# EAGLE design Pro Trinket Keyboard V3.1 (EAGLE 6.6.0)
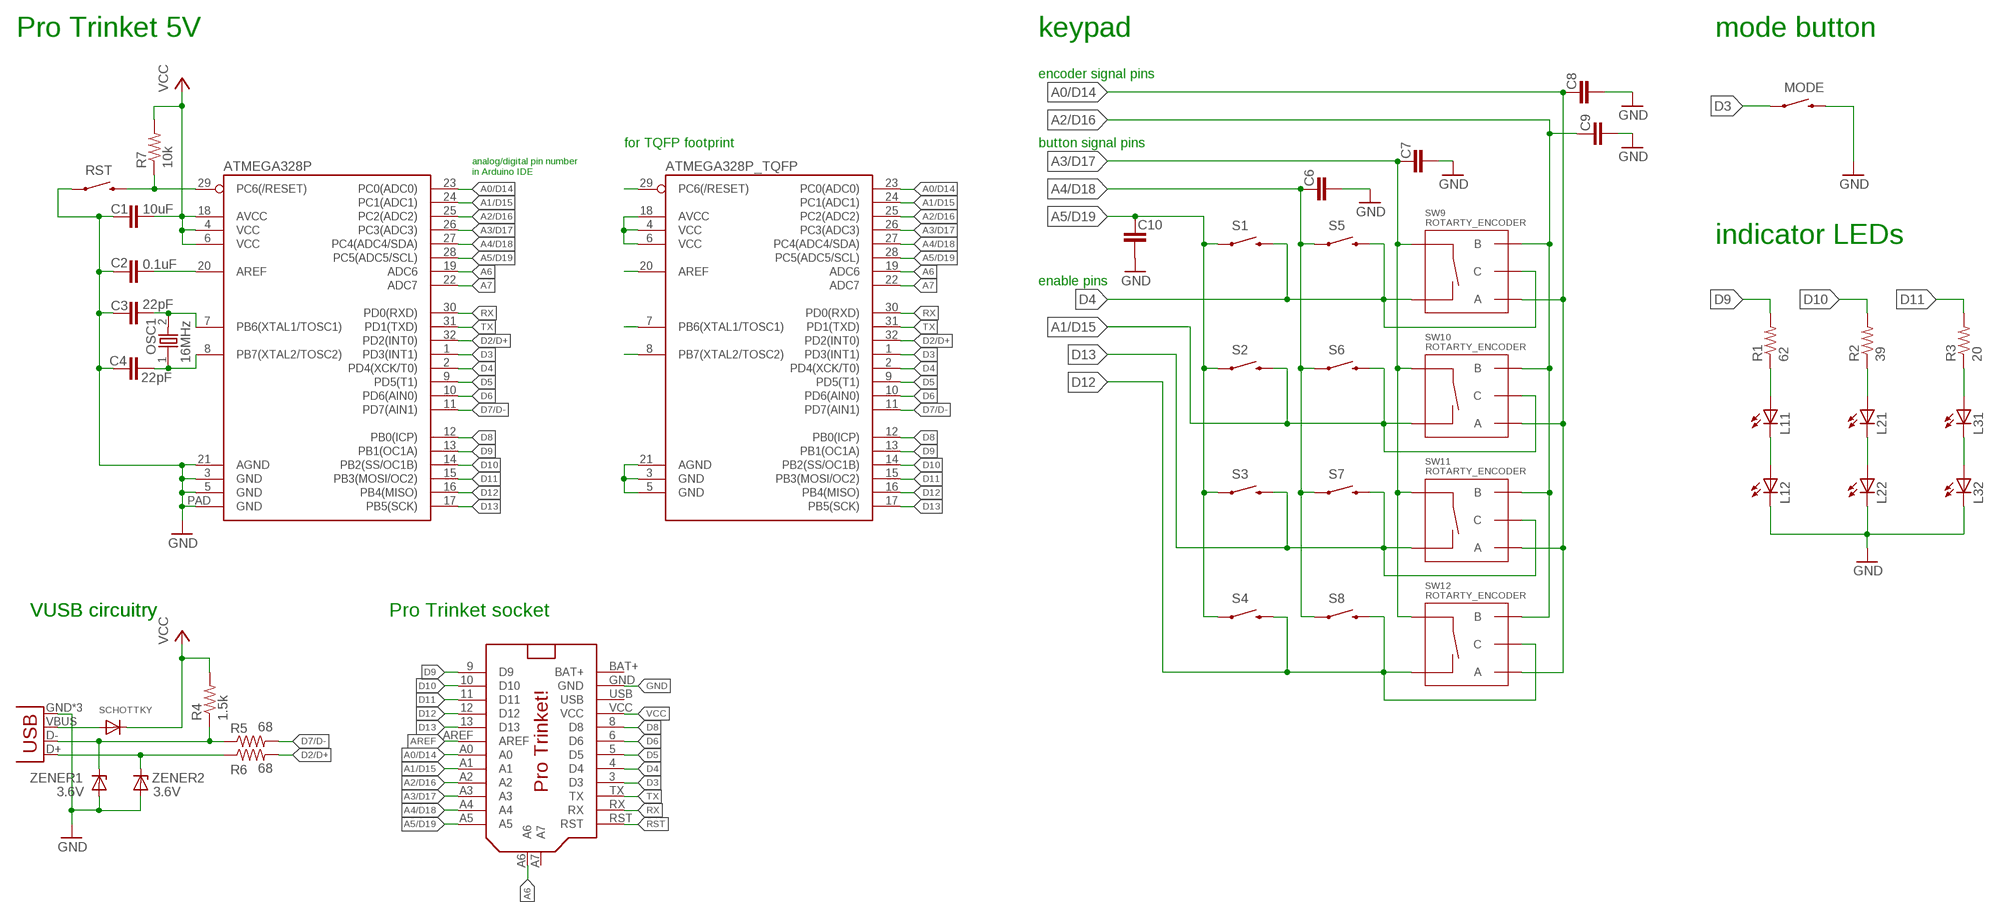
[diagram p0: schematic, sheet 1]

## Parts
ATMEGA328P  ATMEGA328P_MLFMLF32  [MLF32-PAD]
ATMEGA328P_TQFP  ATMEGA328P_TQFP  [TQFP32-08]
C1  10uF  10UF-6.3V-20%(0603)  [0603-CAP]
C2  0.1uF  22PF-50V-5%(0603)  [0603-CAP]
C3  22pF  22PF-50V-5%(0603)  [0603-CAP]
C4  22pF  22PF-50V-5%(0603)  [0603-CAP]
C6  22PF-50V-5%(0603)  [0603-CAP]
C7  22PF-50V-5%(0603)  [0603-CAP]
C8  22PF-50V-5%(0603)  [0603-CAP]
C9  22PF-50V-5%(0603)  [0603-CAP]
C10  22PF-50V-5%(0603)  [0603-CAP]
JP1  USB-MICROB  [USB-MICROB]
L11  LEDCHIPLED_0805  [CHIPLED_0805]
L12  LEDCHIPLED_0805  [CHIPLED_0805]
L21  LEDCHIPLED_0805  [CHIPLED_0805]
L22  LEDCHIPLED_0805  [CHIPLED_0805]
L31  LEDCHIPLED_0805  [CHIPLED_0805]
L32  LEDCHIPLED_0805  [CHIPLED_0805]
MODE  SWITCH-MOMENTARY-2SIDE_EZ  [TACTILE-PTH-SIDEEZ]
OSC1  16MHz  OSC-XTAL-HC-49U-SMD  [HC-49U]
R1  62  R-US_M0805  [M0805]
R2  39  R-US_M0805  [M0805]
R3  20  R-US_M0805  [M0805]
R4  1.5k  RESISTOR0805-RES  [0805]
R5  68  RESISTOR0805-RES  [0805]
R6  68  RESISTOR0805-RES  [0805]
R7  10k  RESISTOR0805-RES  [0805]
RST  SWITCH-MOMENTARY-2SIDE_EZ  [TACTILE-PTH-SIDEEZ]
S1  SWITCH-MOMENTARY-212MM  [TACTILE-PTH-12MM]
S2  SWITCH-MOMENTARY-212MM  [TACTILE-PTH-12MM]
S3  SWITCH-MOMENTARY-212MM  [TACTILE-PTH-12MM]
S4  SWITCH-MOMENTARY-212MM  [TACTILE-PTH-12MM]
S5  SWITCH-MOMENTARY-212MM  [TACTILE-PTH-12MM]
S6  SWITCH-MOMENTARY-212MM  [TACTILE-PTH-12MM]
S7  SWITCH-MOMENTARY-212MM  [TACTILE-PTH-12MM]
S8  SWITCH-MOMENTARY-212MM  [TACTILE-PTH-12MM]
SCHOTTKY  DIODESMA  [SMADIODE]
SW9  ROTARTY_ENCODER  [ROTARY_ENC_PLAIN]
SW10  ROTARTY_ENCODER  [ROTARY_ENC_PLAIN]
SW11  ROTARTY_ENCODER  [ROTARY_ENC_PLAIN]
SW12  ROTARTY_ENCODER  [ROTARY_ENC_PLAIN]
U$2  PRO_TRINKET  [PROTRINKET]
ZENER1  3.6V  ZENER-DIODESOD80C  [SOD80C]
ZENER2  3.6V  ZENER-DIODESOD80C  [SOD80C]

## Nets
A0/D14: ATMEGA328P.23(PC0(ADC0)) ATMEGA328P_TQFP.23(PC0(ADC0)) C8.1 SW9.A SW10.A SW11.A SW12.A U$2.A0
A1/D15: ATMEGA328P.24(PC1(ADC1)) ATMEGA328P_TQFP.24(PC1(ADC1)) S2.3 S2.4 S6.3 S6.4 SW10.C SW10.SW- U$2.A1
A2/D16: ATMEGA328P.25(PC2(ADC2)) ATMEGA328P_TQFP.25(PC2(ADC2)) C9.1 SW9.B SW10.B SW11.B SW12.B U$2.A2
A3/D17: ATMEGA328P.26(PC3(ADC3)) ATMEGA328P_TQFP.26(PC3(ADC3)) C7.1 SW9.SW+ SW10.SW+ SW11.SW+ SW12.SW+ U$2.A3
A4/D18: ATMEGA328P.27(PC4(ADC4/SDA)) ATMEGA328P_TQFP.27(PC4(ADC4/SDA)) C6.1 S5.1 S5.2 S6.1 S6.2 S7.1 S7.2 S8.1 S8.2 U$2.A4
A5/D19: ATMEGA328P.28(PC5(ADC5/SCL)) ATMEGA328P_TQFP.28(PC5(ADC5/SCL)) C10.1 S1.1 S1.2 S2.1 S2.2 S3.1 S3.2 S4.1 S4.2 U$2.A5
A6: ATMEGA328P.19(ADC6) ATMEGA328P_TQFP.19(ADC6) U$2.A6
A7: ATMEGA328P.22(ADC7) ATMEGA328P_TQFP.22(ADC7)
AREF: ATMEGA328P.20(AREF) ATMEGA328P_TQFP.20(AREF) C2.2 U$2.AREF
D2/D+: ATMEGA328P.32(PD2(INT0)) ATMEGA328P_TQFP.32(PD2(INT0)) R6.2
D3: ATMEGA328P.1(PD3(INT1)) ATMEGA328P_TQFP.1(PD3(INT1)) MODE.1 U$2.3(D3)
D4: ATMEGA328P.2(PD4(XCK/T0)) ATMEGA328P_TQFP.2(PD4(XCK/T0)) S1.3 S1.4 S5.3 S5.4 SW9.C SW9.SW- U$2.4(D4)
D5: ATMEGA328P.9(PD5(T1)) ATMEGA328P_TQFP.9(PD5(T1)) U$2.5(D5)
D6: ATMEGA328P.10(PD6(AIN0)) ATMEGA328P_TQFP.10(PD6(AIN0)) U$2.6(D6)
D7/D-: ATMEGA328P.11(PD7(AIN1)) ATMEGA328P_TQFP.11(PD7(AIN1)) R5.2
D8: ATMEGA328P.12(PB0(ICP)) ATMEGA328P_TQFP.12(PB0(ICP)) U$2.8(D8)
D9: ATMEGA328P.13(PB1(OC1A)) ATMEGA328P_TQFP.13(PB1(OC1A)) R1.2 U$2.9(D9)
D10: ATMEGA328P.14(PB2(SS/OC1B)) ATMEGA328P_TQFP.14(PB2(SS/OC1B)) R2.2 U$2.10(D10)
D11: ATMEGA328P.15(PB3(MOSI/OC2)) ATMEGA328P_TQFP.15(PB3(MOSI/OC2)) R3.2 U$2.11(D11)
D12: ATMEGA328P.16(PB4(MISO)) ATMEGA328P_TQFP.16(PB4(MISO)) S4.3 S4.4 S8.3 S8.4 SW12.C SW12.SW- U$2.12(D12)
D13: ATMEGA328P.17(PB5(SCK)) ATMEGA328P_TQFP.17(PB5(SCK)) S3.3 S3.4 S7.3 S7.4 SW11.C SW11.SW- U$2.13(D13)
GND: ATMEGA328P.3(GND) ATMEGA328P.5(GND) ATMEGA328P.21(AGND) ATMEGA328P.PAD(GND) ATMEGA328P_TQFP.3(GND) ATMEGA328P_TQFP.5(GND) ATMEGA328P_TQFP.21(AGND) C1.1 C2.1 C3.1 C4.2 C6.2 C7.2 C8.2 C9.2 C10.2 JP1.GND JP1.MT1(GND) JP1.MT2(GND) L12.C L22.C L32.C MODE.2 RST.1 U$2.GND ZENER1.A ZENER2.A
L31: L31.C L32.A
N$1: L11.A R1.1
N$2: L11.C L12.A
N$3: L21.A R2.1
N$4: L21.C L22.A
N$5: L31.A R3.1
N$10: JP1.VBUS SCHOTTKY.A
N$11: JP1.D- R4.1 R5.1 ZENER1.C
N$12: JP1.D+ R6.1 ZENER2.C
RST: ATMEGA328P.29(PC6(/RESET)) ATMEGA328P_TQFP.29(PC6(/RESET)) R7.1 RST.2 U$2.RST
RX: ATMEGA328P.30(PD0(RXD)) ATMEGA328P_TQFP.30(PD0(RXD)) U$2.RX
TX: ATMEGA328P.31(PD1(TXD)) ATMEGA328P_TQFP.31(PD1(TXD)) U$2.TX
VCC: ATMEGA328P.4(VCC) ATMEGA328P.6(VCC) ATMEGA328P.18(AVCC) ATMEGA328P_TQFP.4(VCC) ATMEGA328P_TQFP.6(VCC) ATMEGA328P_TQFP.18(AVCC) C1.2 R4.2 R7.2 SCHOTTKY.C U$2.VCC
XTAL1: ATMEGA328P.7(PB6(XTAL1/TOSC1)) ATMEGA328P_TQFP.7(PB6(XTAL1/TOSC1)) C3.2 OSC1.2
XTAL2: ATMEGA328P.8(PB7(XTAL2/TOSC2)) ATMEGA328P_TQFP.8(PB7(XTAL2/TOSC2)) C4.1 OSC1.1
Unconnected: U$2.A7

## Notes on the sheet
- Pro Trinket 5V | keypad | mode button
- encoder signal pins
- for TQFP footprint | button signal pins
- analog/digital pin number
  in Arduino IDE
- indicator LEDs
- enable pins
- VUSB circuitry | VUSB circuitry | Pro Trinket socket

## Power pins joined to a net without a drawn wire
BAT+: U$2.BAT+
USB: U$2.USB

## Library data of the parts
ATMEGA328P = SparkFun-DigitalIC:ATMEGA328P_MLF: 32-Pin Atmega328 part Commonly used on Arduino compatible boards Available in QFP and QFN packages TQFP is IC-09069 QFN is non-stock
ATMEGA328P_TQFP = SparkFun-DigitalIC:ATMEGA328P_TQFP; PROD_ID: IC-09069; VALUE: ATMEGA328P_TQFP
C1 = SparkFun-Capacitors:10UF-6.3V-20%(0603): CAP-11015; PROD_ID: CAP-11015
C2 C6-C10 = SparkFun-Capacitors:22PF-50V-5%(0603): CAP-07876; PROD_ID: CAP-07876; VALUE: 22pF
C3 C4 = SparkFun-Capacitors:22PF-50V-5%(0603): CAP-07876; PROD_ID: CAP-07876
JP1 = SparkFun-Connectors:USB: USB Connectors USB-B-PTH is fully proven SKU : PRT-00139/CONN-08278 USB-miniB is fully proven SKU : PRT-00587 USB-A-PCB is untested. USB-A-H is throughly reviewed, but untested. Spark Fun Electronics SKU : PRT-00437 USB-B-SMT is throughly reviewed, but untested. Needs silkscreen touching up. USB-A-S has not been used/tested USB-MB-H has not been used/tested USB-MICROB has been used. CONN-09505; PROD_ID: CONN-09505
L11 L12 L21 L22 L31 L32 = adafruit:LED: LED OSRAM: - CHIPLED LG R971, LG N971, LY N971, LG Q971, LY Q971, LO R971, LY R971 LH N974, LH R974 LS Q976, LO Q976, LY Q976 LO Q996 - Hyper CHIPLED LW Q18S LB Q993, LB Q99A, LB R99A - SideLED LS A670, LO A670, LY A670, LG A670, LP A670 LB A673, LV A673, LT A673, LW A673 LH A674 LY A675 LS A676, LA A676, LO A676, LY A676, LW A676 LS A679, LY A679, LG A679 - Hyper Micro SIDELED® LS Y876, LA Y876, LO Y876, LY Y876 LT Y87S - SmartLED LW L88C, LW L88S LB L89C, LB L89S, LG L890 LS L89K, LO L89K, LY L89K LS L896, LA L896, LO L896, LY L896 - TOPLED LS T670, LO T670, LY T670, LG T670, LP T670 LSG T670, LSP T670, LSY T670, LOP T670, LYG T670 LG T671, LOG T671, LSG T671 LB T673, LV T673, LT T673, LW T673 LH T674 LS T676, LA T676, LO T676, LY T676, LB T676, LH T676, LSB T676, LW T676 LB T67C, LV T67C, LT T67C, LS T67K, LO T67K, LY T67K, LW E67C LS E67B, LA E67B, LO E67B, LY E67B, LB E67C, LV E67C, LT E67C LW T67C LS T679, LY T679, LG T679 LS T770, LO T770, LY T770, LG T770, LP T770 LB T773, LV T773, LT T773, LW T773 LH T774 LS E675, LA E675, LY E675, LS T675 LS T776, LA T776, LO T776, LY T776, LB T776 LHGB T686 LT T68C, LB T68C - Hyper Mini TOPLED® LB M676 - Mini TOPLED Santana® LG M470 LS M47K, LO M47K, LY M47K Source: http://www.osram.convergy.de/
MODE RST = SparkFun-Electromechanical:SWITCH-MOMENTARY-2: Various NO switches- pushbuttons, reed, etc
OSC1 = dp_devices:OSC-XTAL
R1-R3 = adafruit:R-US_: RESISTOR, American symbol
R4-R7 = SparkFun-Passives:RESISTOR: Resistor Basic schematic elements and footprints for 0603, 1206, and PTH resistors.
S1-S8 = SparkFun-Electromechanical:SWITCH-MOMENTARY-2: Various NO switches- pushbuttons, reed, etc; PROD_ID: SWCH-09185
SCHOTTKY = adafruit:DIODE: Diode SMADIODE - SMA Surface Mount Package 20V 1A Schottky Diode Digikey: 641-1014-6-ND DO-1N4148 - Through Hole Small Current Diode SOD-123 20V 1 A (.5mV Vf) Schottky Diode - Digikey: MBRX120TPMSCT-ND SOD-323 10V 570mA (.38mV Vf, 3ns) Schottky Diode - Digikey: ZLLS410CT-ND SOD-523 30V 30mA Schottky Diode (RB751S-40TE61) - Digikey: RB751S-40TE61CT-ND SOT23-R/W - SOT23 Package (R = Solder Paste/Reflow Ovens, W = Hand-Soldering) BAT54Film 40V 300mA - Digikey: 497-7162-1-ND
SW9-SW12 = SparkFun-Electromechanical:ROTARTY_ENCODER: Simple no LED rotary encoder Example: COM-09117
U$2 = adafruit:PRO_TRINKET
ZENER1 ZENER2 = diode:ZENER-DIODE: Z-Diode

## Board
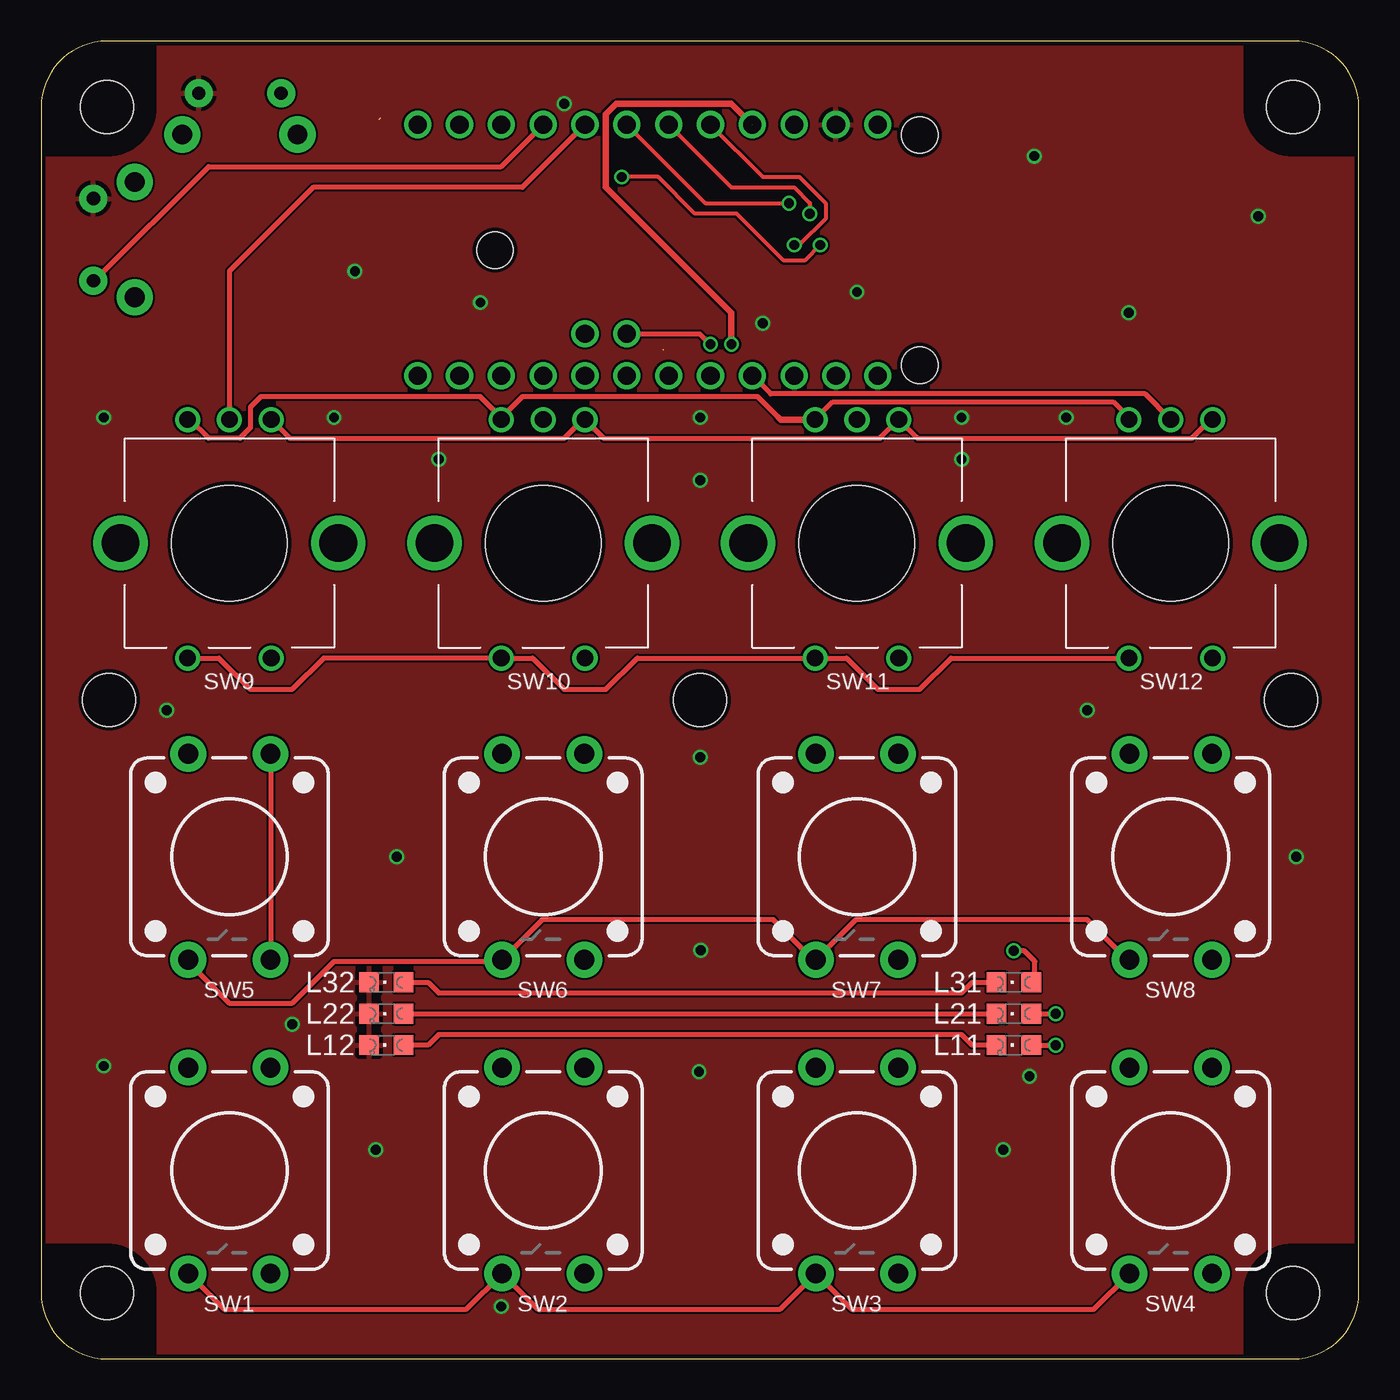
[diagram p1: board, top side]
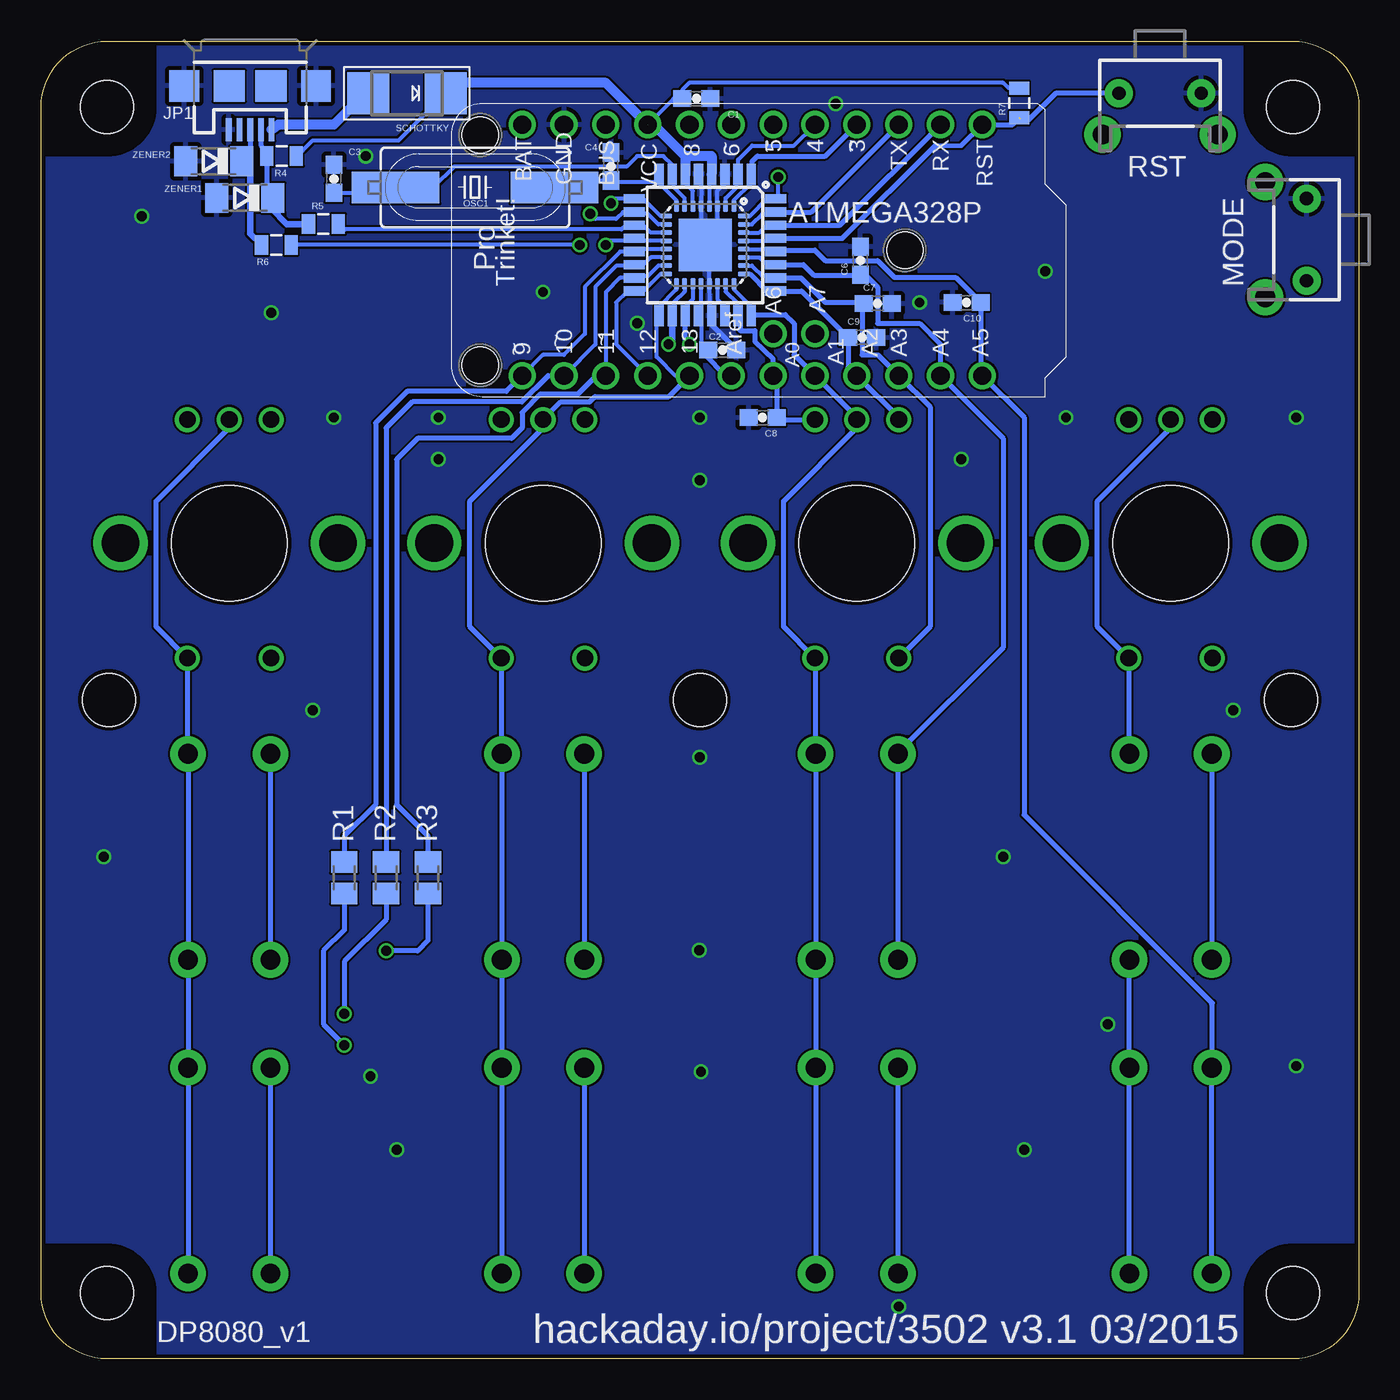
[diagram p2: board, bottom side, seen from below]

Size 80 x 80 mm. Coordinates in mm from the lower left corner, seen from the top.
Copper layers (1*16): Top 0.035mm / dielectric 1.5mm / Bottom 0.035mm
Design rules "dirt_cheap_dirty_boards.v1": minimum track width 5mil, minimum drill 12mil, track to track 5mil, track to pad 5mil, pad to pad 5mil, via to via 5mil, smd to smd 0mil, copper to edge 10mil, drill to drill 10mil, minimum pad ring 10mil, minimum via ring 6mil, stop-mask expansion 2mil, vias tented up to drill 25mil, thermal gap 10mil
Holes 7 mm at 11.43,49.53 30.48,49.53 49.53,49.53 68.58,49.53
Holes 3.2 mm at 40.01,40.01 4.13,40.01 75.88,40.01

### Footprints (pad centres in the part's own frame; a part is rotated, then mirrored left to right if it is on the bottom)
MLF32-PAD = smd 0.7 x 0.3: 1 -2.35,1.75; 2 -2.35,1.25; 3 -2.35,0.75; 4 -2.35,0.25; 5 -2.35,-0.25; 6 -2.35,-0.75; 7 -2.35,-1.25; 8 -2.35,-1.75; 17 2.35,-1.75; 18 2.35,-1.25; 19 2.35,-0.75; 20 2.35,-0.25; 21 2.35,0.25; 22 2.35,0.75; 23 2.35,1.25; 24 2.35,1.75 | smd 0.3 x 0.7: 9 -1.75,-2.35; 10 -1.25,-2.35; 11 -0.75,-2.35; 12 -0.25,-2.35; 13 0.25,-2.35; 14 0.75,-2.35; 15 1.25,-2.35; 16 1.75,-2.35; 25 1.75,2.35; 26 1.25,2.35; 27 0.75,2.35; 28 0.25,2.35; 29 -0.25,2.35; 30 -0.75,2.35; 31 -1.25,2.35; 32 -1.75,2.35 | smd 3.2 x 3.2: PAD 0,0
TQFP32-08 = smd 1.27 x 0.559: 1 -4.293,2.8; 2 -4.293,2; 3 -4.293,1.2; 4 -4.293,0.4; 5 -4.293,-0.4; 6 -4.293,-1.2; 7 -4.293,-2; 8 -4.293,-2.8; 17 4.293,-2.8; 18 4.293,-2; 19 4.293,-1.2; 20 4.293,-0.4; 21 4.293,0.4; 22 4.293,1.2; 23 4.293,2; 24 4.293,2.8 | smd 0.559 x 1.27: 9 -2.8,-4.293; 10 -2,-4.293; 11 -1.2,-4.293; 12 -0.4,-4.293; 13 0.4,-4.293; 14 1.2,-4.293; 15 2,-4.293; 16 2.8,-4.293; 25 2.8,4.293; 26 2,4.293; 27 1.2,4.293; 28 0.4,4.293; 29 -0.4,4.293; 30 -1.2,4.293; 31 -2,4.293; 32 -2.8,4.293
0603-CAP = smd 1.1 x 1: 1 -0.85,0; 2 0.85,0
USB-MICROB = smd 0.35 x 1.4: D+ 0,2.65; D- -0.65,2.65; GND 1.3,2.65; ID 0.65,2.65; VBUS -1.3,2.65 | smd 1.8 x 1.9: MT1 -4,0; MT2 4,0 | smd 1.9 x 1.9: P$1 -1.27,0; P$2 1.27,0
CHIPLED_0805 = smd 1.2 x 1.2: A 0,-1.05; C 0,1.05
TACTILE-PTH-SIDEEZ = drill 0.8 pad 1.7: 1 -2.5,0; 2 2.5,0 | drill 1.2 pad 2.2: ANCHOR1 -3.5,2.5; ANCHOR2 3.5,2.5
HC-49U = smd 5.334 x 1.93: 1 -4.826,0; 2 4.826,0
M0805 = smd 1.3 x 1.6: 1 -0.95,0; 2 0.95,0
0805 = smd 0.8 x 1.2: 1 -0.9,0; 2 0.9,0
TACTILE-PTH-12MM = drill 1.2 pad 2.159: 1 6.25,-2.5; 2 -6.25,-2.5; 3 6.25,2.5; 4 -6.25,2.5
SMADIODE = smd 2.54 x 2.54: A 2.349,0; C -2.349,0
ROTARY_ENC_PLAIN = drill 1.016: A 7.493,-2.54; B 7.493,2.54; C 7.493,0; SW+ -6.985,2.54; SW- -6.985,-2.54 | drill 2.286: P$3 0,6.604; P$4 0,-6.604
DP8080_V1 = hole 3.2: 4,4; 76,4; 76,76; 4,76
PROTRINKET = drill 1.1: 3 7.62,2.921; 4 7.62,5.461; 5 7.62,8.001; 6 7.62,10.541; 8 7.62,13.081; 9 -7.62,23.241; 10 -7.62,20.701; 11 -7.62,18.161; 12 -7.62,15.621; 13 -7.62,13.081; A0 -7.62,8.001; A1 -7.62,5.461; A2 -7.62,2.921; A3 -7.62,0.381; A4 -7.62,-2.159; A5 -7.62,-4.699; A6 -5.08,8.001; A7 -5.08,5.461; AREF -7.62,10.541; BAT+ 7.62,23.241; GND 7.62,20.701; RST 7.62,-4.699; RX 7.62,-2.159; TX 7.62,0.381; USB 7.62,18.161; VCC 7.62,15.621 | hole 2.2: -6.985,25.781; 6.985,25.781; 0,0
SOD80C = smd 1.4 x 1.8: A 1.7,0; C -1.7,0

### Placement (x,y rotation side)
ATMEGA328P  39.69,67.63 270 bottom
ATMEGA328P_TQFP  39.69,67.63 270 bottom
C1  40.23,76.52 180 bottom
C2  38.64,61.25 180 bottom
C3  62.23,71.65 270 bottom
C4  45.4,72.39 90 bottom
C6  30.26,66.67 90 bottom
C7  29.21,64.07 0 bottom
C8  36.2,57.15 180 bottom
C9  30.16,62.01 0 bottom
C10  23.81,64.14 180 bottom
JP1  67.31,77.28 180 bottom
L11  59.05,19.05 90 top
L12  20.95,19.05 90 top
L21  59.05,20.95 90 top
L22  20.95,20.95 90 top
L31  59.05,22.86 90 top
L32  20.95,22.86 90 top
MODE  3.17,67.94 90 bottom
OSC1  53.66,71.12 180 bottom
R1  61.59,29.21 90 bottom
R2  59.05,29.21 90 bottom
R3  56.52,29.21 90 bottom
R4  65.41,73.03 0 bottom
R5  62.87,68.9 0 bottom
R6  65.72,67.63 0 bottom
R7  20.62,76.24 90 bottom
RST  12.06,76.83 180 bottom
S1  11.43,11.43 270 top
S2  30.48,11.43 270 top
S3  49.53,11.43 270 top
S4  68.58,11.43 270 top
S5  11.43,30.48 270 top
S6  30.48,30.48 270 top
S7  49.53,30.48 270 top
S8  68.58,30.48 270 top
SCHOTTKY  57.78,76.83 180 bottom
SW9  11.43,49.53 90 top
SW10  30.48,49.53 90 top
SW11  49.53,49.53 90 top
SW12  68.58,49.53 90 top
U$1  [DP8080_V1]  0,0 0 top
U$2  27.56,67.32 90 bottom
ZENER1  67.63,70.48 180 bottom
ZENER2  69.53,72.71 180 bottom

### Tracks (layer width: path | path; a pad name or v marks a point on that pad's centre or on a via)
A0/D14
  Top 0.305: SW9.A 15.11,55.88 31.75,55.88 32.89,57.02 SW10.A 34.16,55.88 50.93,55.88 SW11.A 53.21,55.88 69.85,55.88 70.99,57.02 SW12.A
  Bottom 0.254: ATMEGA328P.23 38.44,64.79 37.78,64.14 37.78,63.43 ATMEGA328P_TQFP.23 37.56,63.34
  Bottom 0.305: 37.56,63.34 37.56,62.42 36.67,62.42 36.67,61.75 35.56,60.7 U$2.A0 35.34,59.48 C8.1 35.22,57.02 SW10.A
A1/D15
  Bottom 0.254: ATMEGA328P.24 37.94,64.92 36.83,63.82 36.83,63.39 ATMEGA328P_TQFP.24
  Bottom 0.305: SW10.C 30.48,57.15 | SW10.C 30.48,56.52 34.92,52.07 34.92,44.45 SW10.SW- 32.98,42.51 S6.4 S6.3 S2.4 S2.3 | SW10.C 30.48,57.16 U$2.A1 34.28,60.96 34.29,62.87 34.82,63.39 36.83,63.39
A2/D16
  Top 0.305: SW11.B 48.07,58.1 65.09,58.1 66.04,57.15 SW12.B | 44.77,57.15 43.5,58.42 29.21,58.42 27.94,57.15 | 27.94,57.15 SW10.B | 27.94,57.15 26.67,58.42 13.34,58.42 12.7,57.78 12.7,56.52 12.06,55.88 10.16,55.88 9.02,57.02 SW9.B 8.89,57.15
  Top 0.406: 44.77,57.15 44.9,57.02 SW11.B
  Bottom 0.305: SW10.B 27.94,57.16 U$2.A2 31.01,60.23 C9.1 33.83,64.83 ATMEGA328P_TQFP.25 35.45,64.77 35.88,64.77 36.98,65.88 ATMEGA328P.25
A3/D17
  Top 0.305: SW9.SW+ 10.79,42.55 12.7,40.64 15.24,40.64 17.14,42.55 SW10.SW+ 29.84,42.55 31.75,40.64 34.29,40.64 36.2,42.55 SW11.SW+ 48.9,42.55 50.8,40.64 53.34,40.64 55.24,42.55 SW12.SW+
  Bottom 0.254: ATMEGA328P.26 36.85,66.38 36.2,65.72 35.49,65.72 ATMEGA328P_TQFP.26
  Bottom 0.305: SW10.SW+ 26.04,44.45 26.04,57.8 U$2.A3 29.2,60.96 30.16,60.96 30.16,63.97 C7.1 30.12,64.14 32.38,64.14 33.88,65.63 ATMEGA328P_TQFP.26
A4/D18
  Top 0.305: S6.1 30.42,26.67 44.45,26.67 46.89,24.23 S7.1 49.47,26.67 63.5,26.67 65.94,24.23 S8.1 | 8.93,24.09 11.43,21.59 15.24,21.59 17.78,24.13 27.88,24.13
  Top 0.406: S5.2 8.93,36.87 | S5.1 8.93,24.09 | 27.88,24.13 S6.1
  Bottom 0.254: ATMEGA328P.27 36.4,66.88 35.88,66.36 35.47,66.36 ATMEGA328P_TQFP.27
  Bottom 0.305: S8.2 S8.1 | S7.2 S7.1 | S6.1 S6.2 27.98,36.79 21.59,43.18 21.59,55.89 U$2.A4 25.4,61.59 26.67,62.87 29.21,62.87 29.21,65.06 29.94,65.79 C6.1 30.29,65.79 33.09,65.79 33.73,66.43 ATMEGA328P_TQFP.27 | S5.2 S5.1
A5/D19
  Top 0.305: S1.1 8.95,5.18 11.11,3.02 25.82,3.02 S2.1 28,5.18 30.16,3.02 44.87,3.02 S3.1 47.05,5.18 49.21,3.02 63.92,3.02 S4.1
  Bottom 0.254: ATMEGA328P.28 35.4,67.38 ATMEGA328P_TQFP.28
  Bottom 0.305: S1.1 S1.2 8.93,21.55 8.89,21.59 20.32,33.02 20.32,57.16 U$2.A5 22.96,59.8 C10.1 24.49,65.66 28.19,65.66 29.21,66.67 32.38,66.67 33.02,67.31 35.31,67.31 ATMEGA328P_TQFP.28 | S2.2 S2.1 | S3.2 S3.1 | S4.2 S4.1
A6  (via drill 0.6)
  Top 0.305: U$2.A6 40,62.24 v40.64,61.59
  Bottom 0.254: ATMEGA328P.19 40.44,64.34 40.96,63.82 40.96,63.41 ATMEGA328P_TQFP.19
  Bottom 0.305: v40.64,61.59 40.89,61.84 ATMEGA328P_TQFP.19
A7
  Bottom 0.254: ATMEGA328P.22 38.94,64.34 38.42,63.82 38.42,63.41 ATMEGA328P_TQFP.22
AREF
  Bottom 0.254: ATMEGA328P_TQFP.20 39.94,63.34 | 39.94,63.34 ATMEGA328P.20 | 39.94,63.34 39.94,61.73 C2.2 39.69,61.05 39.69,60.96
  Bottom 0.305: U$2.AREF 38.42,59.7 39.69,60.96
D2/D+  (via drill 0.6)
  Top 0.254: v47.31,67.63 46.35,66.67 45.09,66.67 42.23,69.53 39.69,69.53 37.47,71.75 v35.24,71.75
  Bottom 0.254: ATMEGA328P.32 36.98,69.38 35.88,70.48 35.45,70.48 | 35.45,70.48 ATMEGA328P_TQFP.32 | 35.45,70.48 35.24,70.69 v35.24,71.75 | v47.31,67.63 R6.2
D3
  Top 0.305: MODE.1 3.21,65.44 10.16,72.39 27.93,72.39 U$2.3
  Bottom 0.254: ATMEGA328P.1 37.94,70.33 36.83,71.44 36.83,71.86 ATMEGA328P_TQFP.1
  Bottom 0.305: 36.83,71.86 36.83,72.71 36.51,73.03 32.38,73.03 U$2.3
D4
  Top 0.305: SW9.C 11.43,66.04 16.51,71.12 29.21,71.12 33.02,74.93 U$2.4 | S5.4 S5.3
  Bottom 0.254: ATMEGA328P.2 38.44,70.47 37.78,71.12 37.78,71.83 ATMEGA328P_TQFP.2 37.69,72.8 36.83,73.66 34.29,73.66 U$2.4
  Bottom 0.305: S5.4 13.93,42.51 SW9.SW- 15.88,44.45 15.88,52.07 11.43,56.52 SW9.C | S5.3 S1.4 S1.3
D5  (via drill 0.6)
  Top 0.254: U$2.5 40.32,70.17 v45.4,70.17
  Bottom 0.254: ATMEGA328P.9 42.39,69.38 43.5,70.48 43.92,70.48 ATMEGA328P_TQFP.9 45.14,70.43 v45.4,70.17
D6  (via drill 0.6)
  Top 0.254: U$2.6 41.91,71.12 45.72,71.12 46.67,70.17 v46.67,69.53
  Bottom 0.254: ATMEGA328P.10 42.52,68.88 43.18,69.53 43.88,69.53 ATMEGA328P_TQFP.10 44.67,69.63 45.09,69.22 46.35,69.22 v46.67,69.53
D7/D-
  Bottom 0.254: ATMEGA328P.11 42.98,68.38 43.5,68.9 43.91,68.9 ATMEGA328P_TQFP.11 44.52,68.83 44.77,68.58 61.54,68.58 R5.2
D8  (via drill 0.6)
  Top 0.254: U$2.8 43.81,71.75 46.04,71.75 47.62,70.17 47.62,69.22 46.04,67.63 v45.72,67.63
  Bottom 0.254: ATMEGA328P.12 43.98,67.88 | 43.98,67.88 ATMEGA328P_TQFP.12 | 43.98,67.88 45.47,67.88 v45.72,67.63
D9
  Bottom 0.254: ATMEGA328P.13 43.98,67.38 ATMEGA328P_TQFP.13 44.85,67.23 46.99,65.09 46.99,62.23 48.26,60.96 49.53,60.96 U$2.9
  Bottom 0.305: U$2.9 51.76,58.74 57.78,58.74 59.69,56.83 59.69,33.66 61.59,31.75 R1.2
D10
  Bottom 0.254: ATMEGA328P.14 42.98,66.88 43.5,66.36 43.91,66.36 | 43.91,66.36 ATMEGA328P_TQFP.14 | 43.91,66.36 45.09,66.36 46.35,65.09 46.35,61.6 U$2.10
  Bottom 0.305: R2.2 59.05,56.52 57.47,58.1 50.81,58.1 49.22,59.7 U$2.10
D11
  Bottom 0.254: ATMEGA328P.15 42.52,66.38 43.18,65.72 43.88,65.72 ATMEGA328P_TQFP.15 44.86,65.63 45.72,64.77 U$2.11
  Bottom 0.305: R3.2 56.52,31.75 58.42,33.66 58.42,54.61 57.15,55.88 51.44,55.88 50.8,56.52 50.8,57.47 49.69,58.58 47.4,58.58 46.28,59.7 U$2.11
D12
  Top 0.305: SW12.C 67.02,58.58 44.29,58.58 U$2.12
  Bottom 0.254: ATMEGA328P.16 42.39,65.88 43.5,64.77 43.92,64.77 | 43.92,64.77 ATMEGA328P_TQFP.16 | 43.92,64.77 44.45,64.77 45.09,64.14 45.09,61.6 U$2.12
  Bottom 0.305: 68.58,57.15 SW12.C 68.58,56.52 73.03,52.07 73.03,44.45 SW12.SW- 71.12,36.77 S8.4 S8.3 S4.4 S4.3
D13
  Bottom 0.254: ATMEGA328P.17 41.44,64.92 42.55,63.82 42.55,63.39 ATMEGA328P_TQFP.17 42.49,62.95 42.64,62.8 42.64,60.83 41.5,59.69 41.27,59.69 U$2.13
  Bottom 0.305: U$2.13 41.91,58.42 46.39,58.42 46.7,58.1 48.45,58.1 SW11.C 49.53,56.52 53.98,52.07 53.98,44.45 SW11.SW- 52.03,42.51 S7.4 S7.3 S3.4 S3.3
GND  (via drill 0.6)  (1 unrouted)
  Bottom 0.254: ATMEGA328P_TQFP.5 39.94,71.92 ATMEGA328P.5 39.94,67.88 ATMEGA328P.PAD | ATMEGA328P_TQFP.3 38.42,71.85 38.42,71.44 38.94,70.92 ATMEGA328P.3 38.94,68.38 ATMEGA328P.PAD | ATMEGA328P_TQFP.21 39.44,63.48 ATMEGA328P.21 39.44,67.38 ATMEGA328P.PAD
  Bottom 0.305: 37.78,61.28 39.37,62.87 39.37,63.5
  other vias: 43.81,62.87 19.05,66.04 66.04,63.5 63.5,39.37 40.01,36.51 7.62,39.37 24.13,54.61 55.88,54.61 39.94,17.43 58.42,12.7 20.32,12.7 76.2,30.48 3.81,17.78 17.78,57.15 40.04,24.8 27.94,3.17 21.59,30.48 3.81,57.15 60.29,73.03 73.88,69.37 62.23,57.15 55.88,57.15 40.01,57.15 15.24,20.32 26.67,64.14 60.01,17.14 31.75,76.2 49.53,64.77 40.01,53.34
  pour Bottom (rank 6): 0,80.01 80.01,80.01 80.01,0 0,0
  pour Top: 0,80.01 80.01,80.01 80.01,0 0,0
L31
  Top 0.305: L32.A 23.5,22.86 24.13,22.23 55.88,22.23 56.52,22.86 L31.C
N$1  (via drill 0.6)
  Top 0.305: L11.A v61.59,19.05
  Bottom 0.305: R1.1 61.59,26.04 62.87,24.77 62.87,20.32 v61.59,19.05
N$2
  Top 0.305: L11.C 56.52,19.05 55.88,19.68 24.13,19.68 23.5,19.05 L12.A
N$3  (via drill 0.6)
  Top 0.305: L21.A v61.59,20.95
  Bottom 0.305: R2.1 59.05,26.67 61.59,24.13 v61.59,20.95
N$4
  Top 0.305: L22.A L21.C
N$5  (via drill 0.6)
  Top 0.305: L31.A 60.33,23.08 60.33,24.13 59.69,24.77 v59.05,24.77
  Bottom 0.305: R3.1 56.52,25.4 57.15,24.77 v59.05,24.77
N$10
  Bottom 0.61: SCHOTTKY.A 60.33,76.83 62.23,74.93 65.58,74.93 JP1.VBUS
N$11
  Bottom 0.305: JP1.D- 66.66,73.7 R4.1 66.31,71.33 66.16,71.19 ZENER1.C
  Bottom 0.406: R5.1 65.09,68.9 66.04,69.85 66.04,70.37 ZENER1.C
N$12
  Bottom 0.305: JP1.D+ 67.31,73.14 ZENER2.C 67.31,72.91
  Bottom 0.406: 67.31,72.91 67.31,68.31 R6.1
RST  (1 unrouted)
  Bottom 0.254: ATMEGA328P.29 35.4,67.88 ATMEGA328P_TQFP.29
  Bottom 0.305: RST.2 18.41,76.83 20,75.25 20.52,75.25 | R7.1 21.03,74.94 U$2.RST 24.13,73.67 25.72,73.66 31.35,68.03 ATMEGA328P_TQFP.29
RX
  Bottom 0.254: ATMEGA328P.30 36.4,68.38 35.88,68.9 35.47,68.9 ATMEGA328P_TQFP.30
  Bottom 0.305: ATMEGA328P_TQFP.30 31.51,68.83 U$2.RX
TX
  Bottom 0.254: ATMEGA328P.31 36.85,68.88 36.2,69.53 35.49,69.53 ATMEGA328P_TQFP.31
  Bottom 0.305: ATMEGA328P_TQFP.31 33.25,69.63 U$2.TX
VCC  (via drill 0.6)  (1 unrouted)
  Top 0.406: U$2.VCC 41.91,76.2 34.92,76.2 34.29,75.56 34.29,71.12 41.91,63.5 v41.91,61.59
  Bottom 0.254: ATMEGA328P_TQFP.4 39.44,71.92 ATMEGA328P.4 | ATMEGA328P.6 40.44,70.92 40.96,71.44 40.96,71.85 ATMEGA328P_TQFP.6 | ATMEGA328P.18 40.94,64.79 41.59,64.14 41.59,63.43 ATMEGA328P_TQFP.18 | R4.2 64.14,73.34 63.5,73.98 58.29,73.98 SCHOTTKY.C | R7.2 21.26,77.14 21.59,77.47 40.65,77.46 41.08,77.04 C1.2 41.6,76.52 U$2.VCC
  Bottom 0.406: ATMEGA328P_TQFP.18 41.69,61.82 v41.91,61.59
  Bottom 0.61: 40.89,73.03 39.29,73.03 ATMEGA328P_TQFP.4 | 40.89,73.03 ATMEGA328P_TQFP.6 | 40.89,73.03 42.8,74.94 U$2.VCC 45.72,77.47 54.8,77.47 SCHOTTKY.C
XTAL1
  Bottom 0.254: ATMEGA328P.7 40.94,70.47 41.59,71.12 41.59,71.83 ATMEGA328P_TQFP.7 41.69,72.48 42.23,73.03 43.81,73.03 44.45,72.39 54.93,72.39 56.2,71.12 OSC1.2 58.81,70.8 C3.2
XTAL2
  Bottom 0.254: ATMEGA328P.8 41.44,70.33 42.55,71.44 | 42.55,71.44 42.55,71.86 ATMEGA328P_TQFP.8 | 42.55,71.44 45.3,71.44 C4.1 48.41,71.54 OSC1.1

### Text on the board
tNames: SW5 | SW6 | SW7 | SW8 | SW1 | SW2 | SW3 | SW4
bNames: hackaday.io/project/3502 v3.1 03/2015